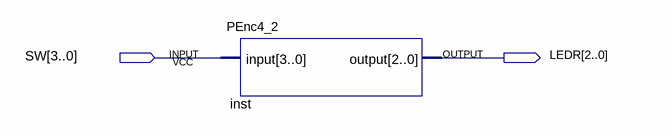
[diagram p0: schematic sheet]
// Quartus schematic PEnc4_2Demo.bdf as structural Verilog: 1 symbols, 2 pins
module PEnc4_2Demo (
  input  [3:0] SW,
  output [2:0] LEDR
);

  PEnc4_2 inst (.\input (SW), .\output (LEDR));
endmodule
